# EAGLE design temperature-sensor (EAGLE 5.00)
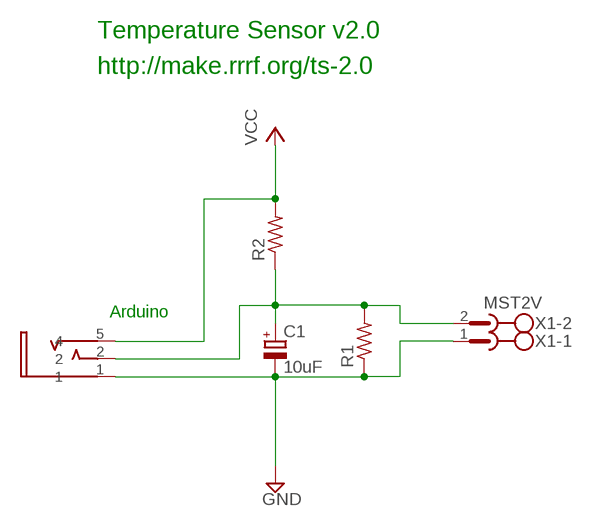
[diagram p0: schematic, sheet 1]

## Parts
C1  10uF  CPOL-EUE2-5  [E2-5]
R1  R-US_0207/7  [0207/7]
R2  R-US_0207/7  [0207/7]
U$1  3.5MM_JACKKYCON  [STX-3081]
X1  MST2V  [MSTBV2]

## Nets
GND: C1.- R1.1 U$1.1 X1.1
N$2: C1.+ R1.2 R2.1 U$1.2 X1.2
VCC: R2.2 U$1.5

## Notes on the sheet
- Temperature Sensor v2.0
- http://make.rrrf.org/ts-2.0
- Arduino

## Library data of the parts
C1 = rcl:CPOL-EU: POLARIZED CAPACITOR, European symbol
R1 R2 = rcl:R-US_: RESISTOR, American symbol
U$1 = reprap:3.5MM_JACK
X1 = con-phoenix-508:MST2V: PHOENIX

## Net classes
0 default: width 0.406 mm, clearance 0.406 mm

## Board
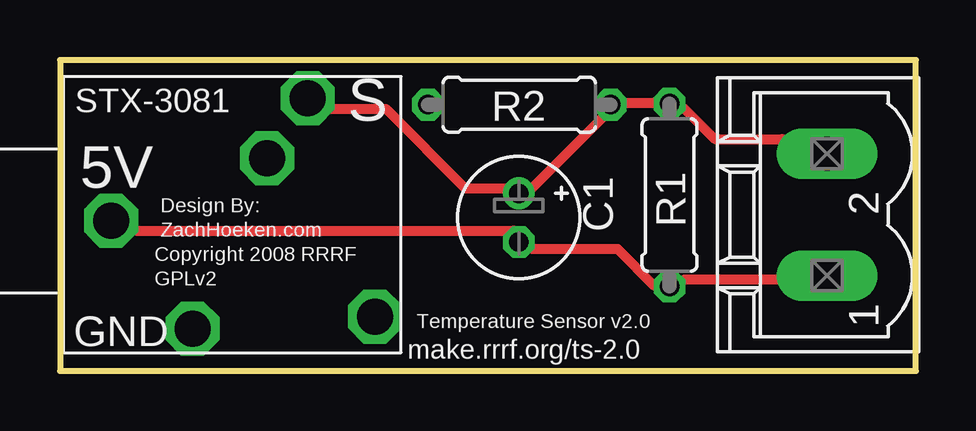
[diagram p1: board, top side]
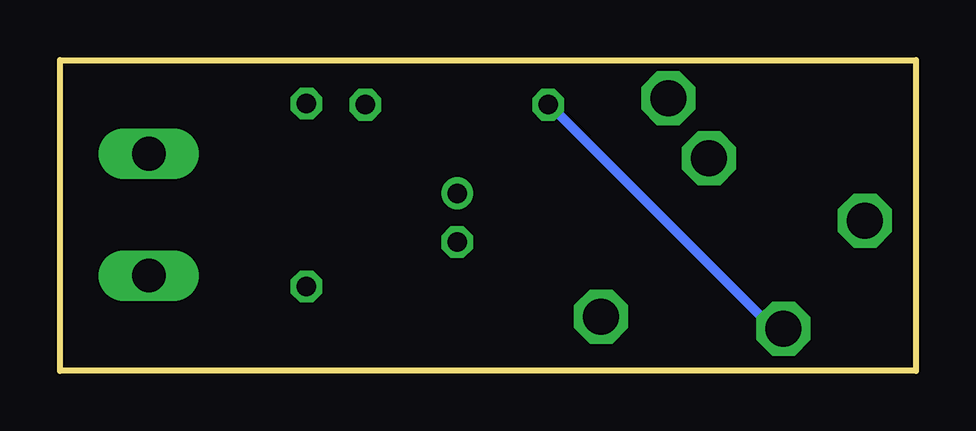
[diagram p2: board, bottom side, seen from below]

Size 35.69 x 12.95 mm. Coordinates in mm from the lower left corner, seen from the top.
Outline: 35.69,12.95 0,12.95 0,0 35.69,0 35.69,12.95
Copper layers (1*16): Top 0.035mm / dielectric 1.5mm / Bottom 0.035mm
Design rules "default": minimum track width 10mil, minimum drill 24mil, track to track 8mil, track to pad 8mil, pad to pad 8mil, via to via 8mil, smd to smd 8mil, copper to edge 40mil, drill to drill 8mil, minimum pad ring 10mil, minimum via ring 8mil, stop-mask expansion 4mil, vias tented up to drill 0mil, thermal gap 10mil

### Footprints (pad centres in the part's own frame; a part is rotated, then mirrored left to right if it is on the bottom)
E2-5 = drill 0.813 pad 1.27 round: + -1.016,0 | drill 0.813 pad 1.27 octagon: - 1.016,0
0207/7 = drill 0.813 octagon: 1 -3.81,0; 2 3.81,0
STX-3081 = drill 1.5 pad 2.184 octagon: 1 2,5.5; 2 10.2,10.6; 3 8.5,8.1; 4 13,1.5; 5 5.4,1
MSTBV2 = drill 1.397 long: 1 -2.54,0; 2 2.54,0

### Placement (x,y rotation side)
C1  19.13,6.38 270 top
R1  25.41,7.33 90 top
R2  19.15,11.09 180 top
U$1  0.13,0.76 0 top
X1  31.98,6.51 90 top

### Tracks (layer width: path | path; a pad name or v marks a point on that pad's centre or on a via)
GND
  Top 0.406: X1.1 30.1,3.81 26.03,3.81 R1.1 24.77,3.56 23.24,5.08 19.68,5.08 C1.- 18.92,5.84 3.17,5.84 U$1.1
N$2
  Top 0.406: X1.2 30.1,9.65 27.3,9.65 26.03,10.92 R1.2 24.77,11.18 23.49,11.18 R2.1 22.73,10.67 19.68,7.62 C1.+ 18.67,7.62 16.89,7.62 13.59,10.92 11.3,10.92 U$1.2
VCC
  Bottom 0.406: R2.2 14.86,10.67 6.48,2.29 U$1.5

### Text on the board
tPlace: S | 5V | Design By: | ZachHoeken.com | Copyright 2008 RRRF | GPLv2 | GND | Temperature Sensor v2.0 | make.rrrf.org/ts-2.0